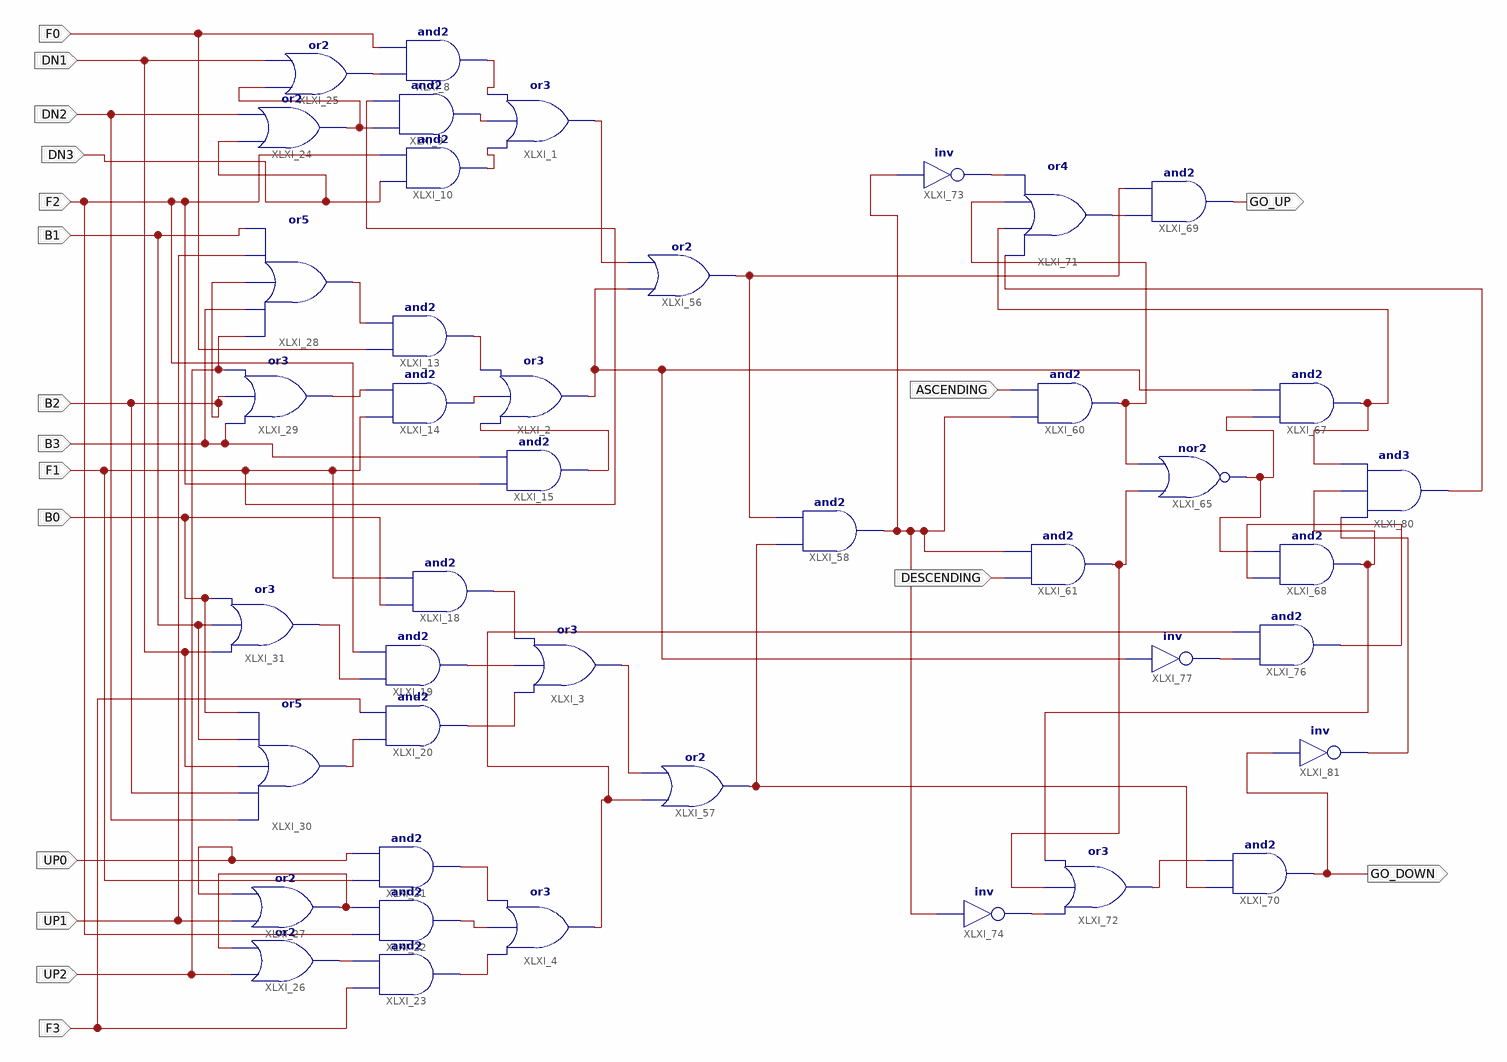
[diagram p0: schematic sheet 1]
// Xilinx ISE schematic Assign1_2018CS10363__2018CS50098.sch (spartan6) as structural Verilog: 42 symbols, 18 ports
module Assign1_2018CS10363__2018CS50098 (
  input  F3,
  input  F0,
  input  DN2,
  input  F2,
  input  F1,
  input  DN3,
  input  DN1,
  input  UP0,
  input  UP1,
  input  UP2,
  input  B3,
  input  B2,
  input  B1,
  input  B0,
  input  ASCENDING,
  input  DESCENDING,
  output GO_UP,
  output GO_DOWN
);

  wire XLXN_5, XLXN_7, XLXN_8, XLXN_11, XLXN_13, XLXN_14, XLXN_17, XLXN_18, XLXN_19, XLXN_20, XLXN_21,
       XLXN_22, XLXN_34, XLXN_41, XLXN_45, XLXN_46, XLXN_86, XLXN_94, XLXN_95, XLXN_96, XLXN_120, XLXN_121,
       XLXN_122, XLXN_130, XLXN_131, XLXN_134, XLXN_135, XLXN_138, XLXN_139, XLXN_143, XLXN_147, XLXN_149,
       XLXN_151, XLXN_154, XLXN_157, XLXN_161, XLXN_162, XLXN_163, XLXN_166, XLXN_167;

  or XLXI_2 (XLXN_163, XLXN_14, XLXN_13, XLXN_11);
  and XLXI_21 (XLXN_20, F1, UP0);
  and XLXI_22 (XLXN_21, F2, XLXN_94);
  and XLXI_23 (XLXN_22, F3, XLXN_41);
  or XLXI_4 (XLXN_121, XLXN_22, XLXN_21, XLXN_20);
  or XLXI_1 (XLXN_122, XLXN_8, XLXN_7, XLXN_5);
  and XLXI_8 (XLXN_5, XLXN_34, F0);
  and XLXI_9 (XLXN_7, XLXN_45, F1);
  and XLXI_10 (XLXN_8, DN3, F2);
  and XLXI_14 (XLXN_13, F1, XLXN_46);
  or XLXI_26 (XLXN_41, UP2, XLXN_94);
  or XLXI_27 (XLXN_94, UP1, UP0);
  or XLXI_25 (XLXN_34, XLXN_45, DN1);
  or XLXI_28 (XLXN_86, UP2, B3, B2, UP1, B1);
  and XLXI_18 (XLXN_17, B0, F1);
  and XLXI_19 (XLXN_18, XLXN_95, F2);
  and XLXI_20 (XLXN_19, XLXN_96, F3);
  or XLXI_3 (XLXN_120, XLXN_19, XLXN_18, XLXN_17);
  or XLXI_30 (XLXN_96, DN2, B2, DN1, B1, B0);
  or XLXI_31 (XLXN_95, DN1, B1, B0);
  or XLXI_24 (XLXN_45, DN3, DN2);
  or XLXI_29 (XLXN_46, B3, B2, UP2);
  and XLXI_15 (XLXN_14, F2, B3);
  and XLXI_13 (XLXN_11, F0, XLXN_86);
  or XLXI_56 (XLXN_138, XLXN_163, XLXN_122);
  or XLXI_57 (XLXN_139, XLXN_121, XLXN_120);
  and XLXI_58 (XLXN_143, XLXN_139, XLXN_138);
  and XLXI_60 (XLXN_147, XLXN_143, ASCENDING);
  and XLXI_61 (XLXN_149, DESCENDING, XLXN_143);
  nor XLXI_65 (XLXN_151, XLXN_149, XLXN_147);
  and XLXI_67 (XLXN_154, XLXN_151, XLXN_163);
  and XLXI_68 (XLXN_157, XLXN_161, XLXN_151);
  and XLXI_69 (GO_UP, XLXN_130, XLXN_138);
  and XLXI_70 (GO_DOWN, XLXN_139, XLXN_131);
  or XLXI_71 (XLXN_130, XLXN_166, XLXN_154, XLXN_147, XLXN_134);
  or XLXI_72 (XLXN_131, XLXN_135, XLXN_149, XLXN_157);
  not XLXI_73 (XLXN_134, XLXN_143);
  not XLXI_74 (XLXN_135, XLXN_143);
  and XLXI_76 (XLXN_161, XLXN_162, XLXN_121);
  not XLXI_77 (XLXN_162, XLXN_163);
  and XLXI_80 (XLXN_166, XLXN_167, XLXN_157, XLXN_154);
  not XLXI_81 (XLXN_167, GO_DOWN);
endmodule
